# EAGLE design LedSymbols (EAGLE 6.1)
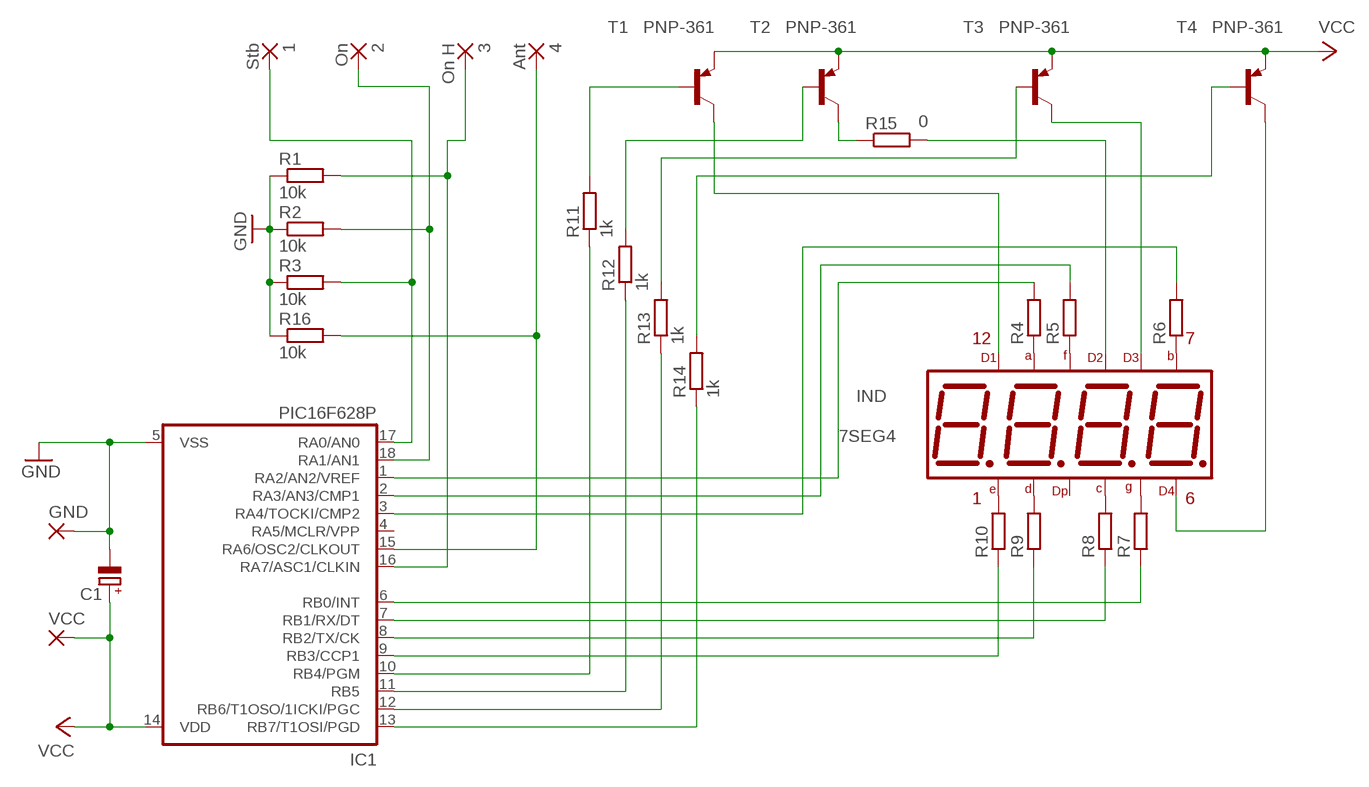
[diagram p0: schematic, sheet 1]

## Parts
1  Stb  1,6/0,8  [1,6/0,8]
2  On  1,6/0,8  [1,6/0,8]
3  On H  1,6/0,8  [1,6/0,8]
4  Ant  1,6/0,8  [1,6/0,8]
C1  CPOL-EUSMCC  [SMC_C]
GND  2,15/1,0  [2,15/1,0]
IC1  PIC16F628P  [DIL18]
IND  7SEG4  [7SEG4]
R1  10k  R-EU_M0805  [M0805]
R2  10k  R-EU_M0805  [M0805]
R3  10k  R-EU_M0805  [M0805]
R4  R-EU_M0805  [M0805]
R5  R-EU_M0805  [M0805]
R6  R-EU_M0805  [M0805]
R7  R-EU_M0805  [M0805]
R8  R-EU_M0805  [M0805]
R9  R-EU_M0805  [M0805]
R10  R-EU_M0805  [M0805]
R11  1k  R-EU_M0805  [M0805]
R12  1k  R-EU_M0805  [M0805]
R13  1k  R-EU_M0805  [M0805]
R14  1k  R-EU_M0805  [M0805]
R15  0  R-EU_M1206  [M1206]
R16  10k  R-EU_M0805  [M0805]
T1  PNP-361  [PNP-361]
T2  PNP-361  [PNP-361]
T3  PNP-361  [PNP-361]
T4  PNP-361  [PNP-361]
VCC  2,15/1,0  [2,15/1,0]

## Nets
GND: C1.- GND.1(P) IC1.5(VSS) R1.1 R2.1 R3.1 R16.1
N$1: IND.E R10.2
N$2: IND.D1 T1.C
N$3: R14.2 T4.B
N$4: IC1.6(RB0/INT) R7.1
N$5: IC1.7(RB1/RX/DT) R8.1
N$6: IND.D2 R15.2
N$7: IND.D3 T3.C
N$8: IND.D R9.2
N$9: IND.C R8.2
N$10: IND.G R7.2
N$11: IND.A R4.1
N$12: IND.F R5.1
N$13: IND.B R6.1
N$14: IND.D4 T4.C
N$15: IC1.8(RB2/TX/CK) R9.1
N$16: IC1.10(RB4/PGM) R11.1
N$17: IC1.11(RB5) R12.1
N$18: R13.2 T3.B
N$19: IC1.9(RB3/CCP1) R10.1
N$20: IC1.1(RA2/AN2/VREF) R4.2
N$21: 1.1(P) IC1.17(RA0/AN0) R3.2
N$22: 2.1(P) IC1.18(RA1/AN1) R2.2
N$23: 3.1(P) IC1.16(RA7/ASC1/CLKIN) R1.2
N$24: IC1.2(RA3/AN3/CMP1) R5.2
N$25: IC1.3(RA4/TOCKI/CMP2) R6.2
N$26: R12.2 T2.B
N$27: R11.2 T1.B
N$28: IC1.12(RB6/T1OSO/1ICKI/PGC) R13.1
N$29: IC1.13(RB7/T1OSI/PGD) R14.1
N$30: R15.1 T2.C
N$31: 4.1(P) IC1.15(RA6/OSC2/CLKOUT) R16.2
VCC: C1.+ IC1.14(VDD) T1.E T2.E T3.E T4.E VCC.1(P)
Unconnected: IC1.4(RA5/MCLR/VPP) IND.DP

## Library data of the parts
1-4 = wirepad:1,6/0,8: THROUGH-HOLE PAD
C1 = rcl:CPOL-EU: POLARIZED CAPACITOR, European symbol
GND VCC = wirepad:2,15/1,0: THROUGH-HOLE PAD
IC1 = microchip:PIC16*F62: FLASH-Based 8-Bit CMOS Microcontroller Source: http://ww1.microchip.com/downloads/en/DeviceDoc/40300C.pdf; MF: MICROCHIP; MPN: PIC16F628-20/P; OC_FARNELL: 9760423; OC_NEWARK: 23C4982
IND = 1mano:7SEG4
R1-R16 = rcl:R-EU_: RESISTOR, European symbol
T1-T4 = 1mano:PNP-361

## Board
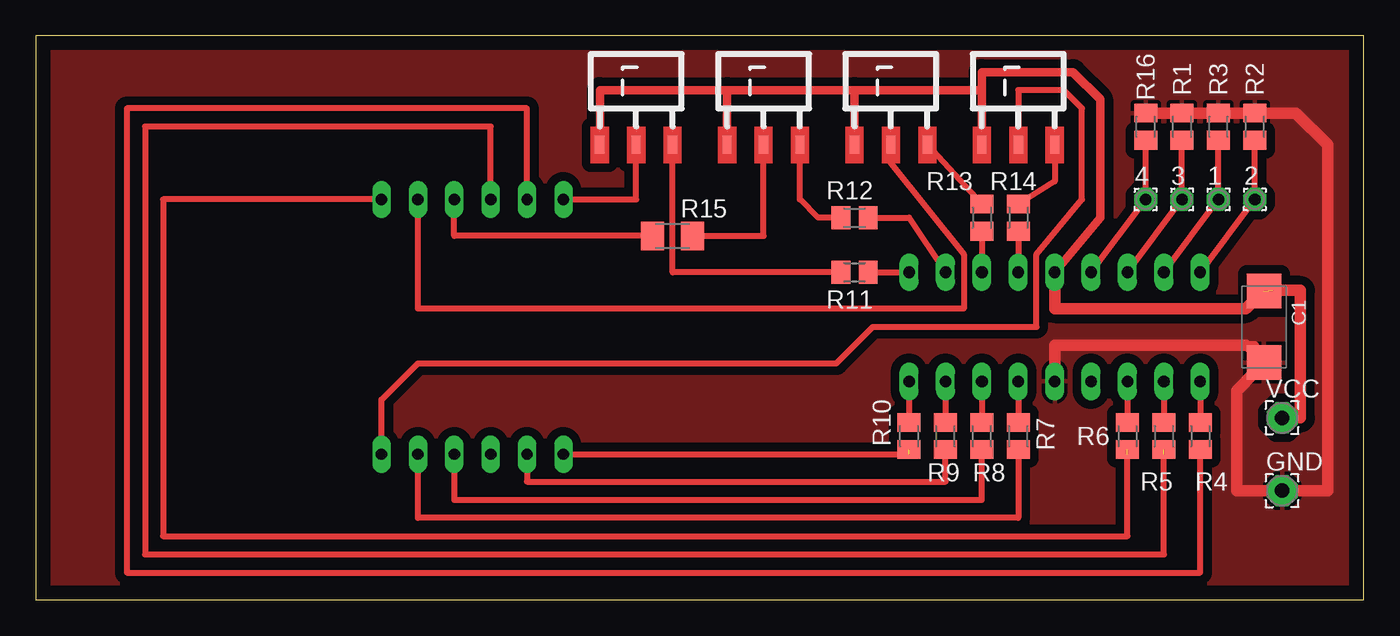
[diagram p1: board, top side]
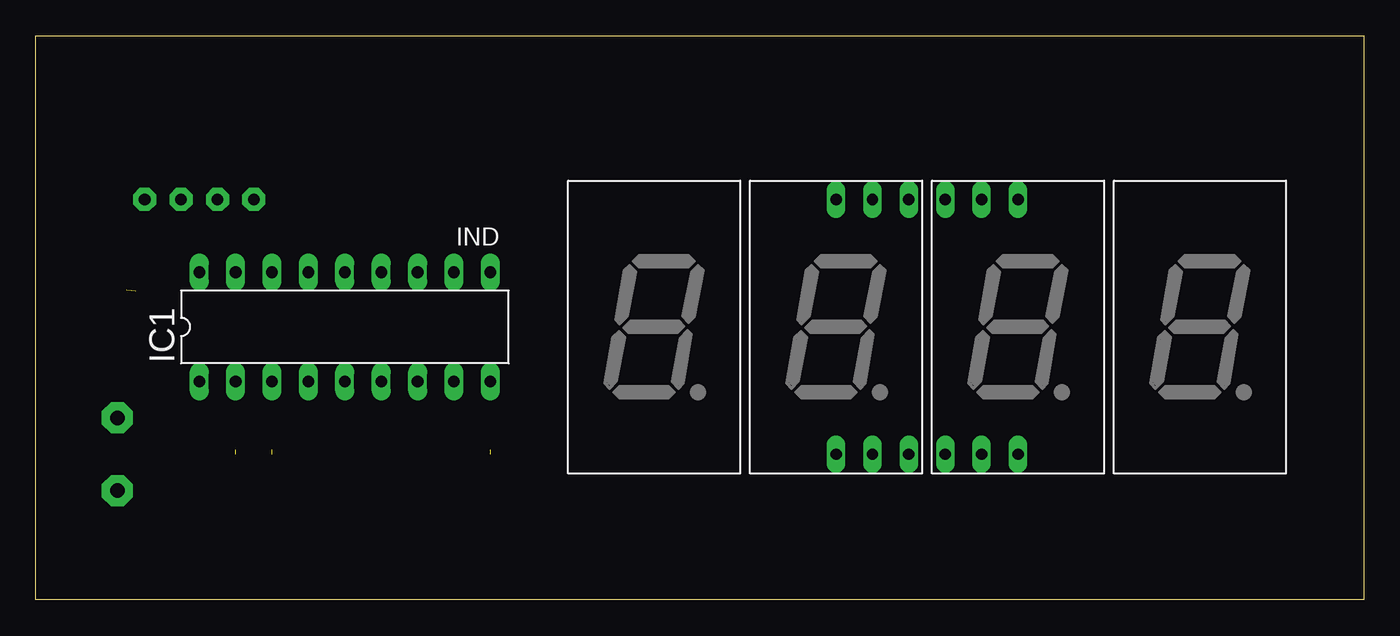
[diagram p2: board, bottom side, seen from below]

Size 92.69 x 39.36 mm. Coordinates in mm from the lower left corner, seen from the top.
Outline: 0,0 92.69,0 92.69,39.36 0,39.36 0,0
Copper layers (1*16): Top 0.035mm / dielectric 1.5mm / Bottom 0.035mm
Design rules: minimum track width 10mil, minimum drill 24mil, track to track 8mil, track to pad 8mil, pad to pad 8mil, via to via 8mil, smd to smd 8mil, copper to edge 40mil, drill to drill 8mil, minimum pad ring 10mil, minimum via ring 8mil, stop-mask expansion 4mil, vias tented up to drill 0mil, thermal gap 10mil

### Footprints (pad centres in the part's own frame; a part is rotated, then mirrored left to right if it is on the bottom)
1,6/0,8 = drill 0.813 pad 1.6 octagon: 1 0,0
SMC_C = smd 2.4 x 2.4: + -2.5,0; - 2.5,0
2,15/1,0 = drill 1.016 pad 2.159 octagon: 1 0,0
DIL18 = drill 0.813 long: 1 -10.16,-3.81; 2 -7.62,-3.81; 3 -5.08,-3.81; 4 -2.54,-3.81; 5 0,-3.81; 6 2.54,-3.81; 7 5.08,-3.81; 8 7.62,-3.81; 9 10.16,-3.81; 10 10.16,3.81; 11 7.62,3.81; 12 5.08,3.81; 13 2.54,3.81; 14 0,3.81; 15 -2.54,3.81; 16 -5.08,3.81; 17 -7.62,3.81; 18 -10.16,3.81
7SEG4 = drill 0.8 pad 1.27 long: A 10.16,6.35; B 20.32,6.35; C 15.24,-11.43; D 10.16,-11.43; D1 7.62,6.35; D2 15.24,6.35; D3 17.78,6.35; D4 20.32,-11.43; DP 12.7,-11.43; E 7.62,-11.43; F 12.7,6.35; G 17.78,-11.43
M0805 = smd 1.3 x 1.6: 1 -0.95,0; 2 0.95,0
M1206 = smd 1.6 x 2: 1 -1.4,0; 2 1.4,0
PNP-361 = smd 1.27 x 0.635: B 0,-2.54; C 0,0; E 0,2.54

### Placement (x,y rotation side)
1  82.55,27.94 0 top
2  85.09,27.94 0 top
3  80.01,27.94 0 top
4  77.47,27.94 0 top
C1  85.72,19.05 270 top
GND  87,7.62 0 top
IC1  71.12,19.05 0 bottom
IND  44.45,21.59 0 bottom
R1  80.01,33.02 270 top
R2  85.09,33.02 270 top
R3  82.55,33.02 270 top
R4  81.28,11.43 90 top
R5  78.74,11.43 90 top
R6  76.2,11.43 90 top
R7  68.58,11.43 270 top
R8  66.04,11.43 270 top
R9  63.5,11.43 270 top
R10  60.96,11.43 270 top
R11  57.15,22.86 180 top
R12  57.15,26.67 180 top
R13  66.04,26.67 90 top
R14  68.58,26.67 90 top
R15  44.45,25.4 180 top
R16  77.47,33.02 270 top
T1  41.91,31.75 90 top
T2  50.8,31.75 90 top
T3  59.69,31.75 90 top
T4  68.58,31.75 90 top
VCC  87,12.7 0 top

### Tracks (layer width: path | path; a pad name or v marks a point on that pad's centre or on a via)
GND
  Top 0.61: 85.09,16.51 85.09,17.78 84.45,17.78 C1.- 85.13,16.55 85.09,16.51 | 85.09,16.51 85.09,15.88
  Top 0.813: IC1.5 71.12,17.78 81.92,17.78 84.45,17.78 | R16.1 R1.1 R3.1 R2.1 87.95,33.97 90.17,31.75 90.17,7.62 GND.1 83.82,7.62 83.82,14.61 85.09,15.88
  pour Top (isolate 0.61): 0,39.37 92.71,39.37 92.71,0 0,0
N$1  (1 unrouted)
  Top 0.406: IND.E 60.96,10.16
N$2
  Top 0.406: IND.D1 41.91,27.94 T1.C
N$3
  Top 0.406: T4.B 71.12,29.21 R14.2
N$4
  Top 0.406: IC1.6 R7.1
N$5
  Top 0.406: IC1.7 R8.1
N$6
  Top 0.406: R15.2 29.21,25.4 IND.D2
N$7
  Top 0.406: T3.C 59.69,30.48 64.77,24.13 64.77,20.32 26.67,20.32 IND.D3
N$8
  Top 0.406: IND.D 34.29,8.25 63.5,8.25 R9.2
N$9
  Top 0.406: IND.C 29.21,6.99 66.04,6.99 R8.2
N$10
  Top 0.406: R7.2 68.58,5.71 26.67,5.71 IND.G
N$11
  Top 0.406: IND.A 34.29,34.29 6.35,34.29 6.35,1.91 81.28,1.91 R4.1
N$12  (1 unrouted)
  Top 0.406: IND.F 31.75,33.02 7.62,33.02 7.62,3.17 78.74,3.17 78.74,10.16
N$13  (1 unrouted)
  Top 0.406: IND.B 8.89,27.94 8.89,4.45 76.2,4.45 76.2,10.16
N$14
  Top 0.406: IND.D4 24.13,13.97 26.67,16.51 55.88,16.51 58.42,19.05 69.85,19.05 69.85,24.13 73.03,27.94 73.03,34.29 71.75,35.56 68.58,35.56 T4.C
N$15
  Top 0.406: IC1.8 R9.1
N$16
  Top 0.406: R11.1 IC1.10
N$17
  Top 0.406: R12.1 60.96,26.67 IC1.11
N$18
  Top 0.406: R13.2 T3.B
N$19
  Top 0.406: IC1.9 R10.1
N$20
  Top 0.406: IC1.1 R4.2
N$21
  Top 0.406: IC1.17 1.1 R3.2
N$22
  Top 0.406: IC1.18 2.1 R2.2
N$23
  Top 0.406: IC1.16 3.1 R1.2
N$24
  Top 0.406: IC1.2 R5.2
N$25
  Top 0.406: IC1.3 R6.2
N$26
  Top 0.406: R12.2 54.61,26.67 53.34,27.94 T2.B
N$27
  Top 0.406: R11.2 44.45,22.86 T1.B
N$28
  Top 0.406: R13.1 IC1.12
N$29
  Top 0.406: R14.1 IC1.13
N$30
  Top 0.406: R15.1 50.8,25.4 T2.C
N$31
  Top 0.406: IC1.15 4.1 R16.2
VCC  (1 unrouted)
  Top 0.406: 66.04,35.56 T4.E
  Top 0.61: T1.E 39.37,35.56 48.26,35.56 | T2.E 48.26,35.56 | 48.26,35.56 57.15,35.56 | T3.E 57.15,35.56 | 57.15,35.56 66.04,35.56 | T4.E 66.04,36.83 72.39,36.83 74.3,34.92 74.3,26.67 IC1.14
  Top 0.813: IC1.14 71.12,20.32 84.45,20.32 C1.+ | VCC.1 88.27,12.7 88.27,21.59 86.36,21.59